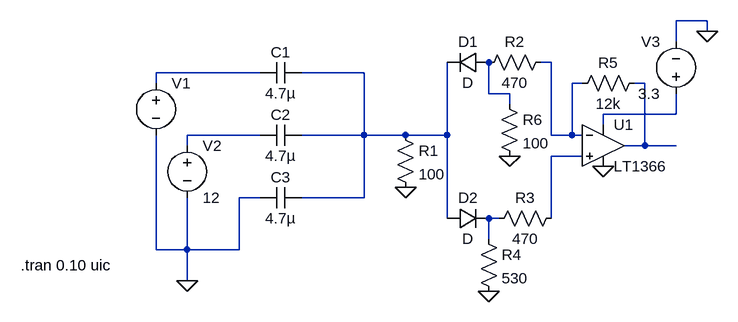
[diagram p0: schematic commSystemDesign.asc]
commSystemDesign.asc, the LTspice schematic file:
Version 4
SHEET 1 1236 680
WIRE 752 -32 704 -32
WIRE 752 -16 752 -32
WIRE 704 0 704 -32
WIRE 512 32 496 32
WIRE 64 48 -96 48
WIRE 224 48 128 48
WIRE -96 64 -96 48
WIRE 560 64 544 64
WIRE 656 64 640 64
WIRE 416 80 416 32
WIRE 448 80 416 80
WIRE 448 96 448 80
WIRE 704 112 704 80
WIRE 704 112 592 112
WIRE 592 128 592 112
WIRE 64 144 -48 144
WIRE 224 144 224 48
WIRE 224 144 128 144
WIRE 288 144 224 144
WIRE 352 144 352 32
WIRE 352 144 288 144
WIRE 512 144 512 32
WIRE 544 144 544 64
WIRE 544 144 512 144
WIRE 560 144 544 144
WIRE -48 160 -48 144
WIRE 656 160 656 64
WIRE 656 160 624 160
WIRE 704 160 656 160
WIRE 560 176 512 176
WIRE 64 240 32 240
WIRE 224 240 224 144
WIRE 224 240 128 240
WIRE 352 272 352 144
WIRE 432 272 416 272
WIRE 512 272 512 176
WIRE 416 304 416 272
WIRE -96 320 -96 144
WIRE -48 320 -48 240
WIRE -48 320 -96 320
WIRE 32 320 32 240
WIRE 32 320 -48 320
WIRE -48 368 -48 320
FLAG -48 368 0
FLAG 288 224 0
FLAG 448 176 0
FLAG 592 192 0
FLAG 752 -16 0
FLAG 416 384 0
SYMBOL cap 128 32 R90
WINDOW 0 0 32 VBottom 2
WINDOW 3 32 32 VTop 2
SYMATTR InstName C1
SYMATTR Value 4.7µ
SYMBOL voltage -96 48 R0
WINDOW 3 -509 103 Invisible 2
WINDOW 123 0 0 Left 2
WINDOW 39 0 0 Left 2
SYMATTR Value PULSE(0 5 0 0.000000000000001 0.000000000000001 0.010 0.020 10)
SYMATTR InstName V1
SYMBOL voltage -48 144 R0
WINDOW 123 0 0 Left 2
WINDOW 39 0 0 Left 2
SYMATTR InstName V2
SYMATTR Value 12
SYMBOL cap 128 128 R90
WINDOW 0 0 32 VBottom 2
WINDOW 3 32 32 VTop 2
SYMATTR InstName C2
SYMATTR Value 4.7µ
SYMBOL cap 128 224 R90
WINDOW 0 0 32 VBottom 2
WINDOW 3 32 32 VTop 2
SYMATTR InstName C3
SYMATTR Value 4.7µ
SYMBOL res 272 128 R0
SYMATTR InstName R1
SYMATTR Value 100
SYMBOL diode 416 16 R90
WINDOW 0 0 32 VBottom 2
WINDOW 3 32 32 VTop 2
SYMATTR InstName D1
SYMBOL diode 352 288 R270
WINDOW 0 32 32 VTop 2
WINDOW 3 0 32 VBottom 2
SYMATTR InstName D2
SYMBOL res 512 16 R90
WINDOW 0 0 56 VBottom 2
WINDOW 3 32 56 VTop 2
SYMATTR InstName R2
SYMATTR Value 470
SYMBOL res 528 256 R90
WINDOW 0 0 56 VBottom 2
WINDOW 3 32 56 VTop 2
SYMATTR InstName R3
SYMATTR Value 470
SYMBOL Opamps\\LT1366 592 96 R0
SYMATTR InstName U1
SYMBOL res 656 48 R90
WINDOW 0 0 56 VBottom 2
WINDOW 3 32 56 VTop 2
SYMATTR InstName R5
SYMATTR Value 12k
SYMBOL res 432 80 R0
SYMATTR InstName R6
SYMATTR Value 100
SYMBOL voltage 704 96 R180
WINDOW 0 24 96 Left 2
WINDOW 3 24 16 Left 2
SYMATTR InstName V3
SYMATTR Value 3.3
SYMBOL res 400 288 R0
SYMATTR InstName R4
SYMATTR Value 530
TEXT -304 344 Left 2 !.tran 0.10 uic

The netlist it stands for:
* commSystemDesign.asc
C1 N003 N002 4.7µ
V1 N002 0 PULSE(0 5 0 0.000000000000001 0.000000000000001 0.010 0.020 10)
V2 N007 0 12
C2 N003 N007 4.7µ
C3 N003 0 4.7µ
R1 N003 0 100
D1 N005 N003 D
D2 N003 N009 D
R2 N001 N005 470
R3 N008 N009 470
XU1 N008 N001 N006 0 N004 LT1366  ; pins In+ In- V+ V- OUT
R5 N004 N001 12k
R6 N005 0 100
V3 N006 0 3.3
R4 N009 0 530
.model D D
.lib standard.dio
.tran 0.10 uic
.lib LTC.lib
.backanno
.end